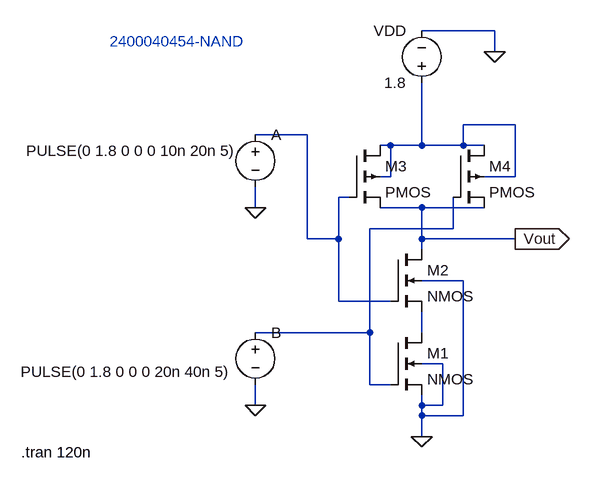
[diagram p0: schematic Nand Schematic Design.asc]
Nand Schematic Design.asc, the LTspice schematic file:
Version 4.1
SHEET 1 880 680
WIRE 368 -256 256 -256
WIRE 368 -224 368 -256
WIRE 400 -112 320 -112
WIRE 80 -96 0 -96
WIRE 208 -80 192 -80
WIRE 256 -80 256 -176
WIRE 256 -80 208 -80
WIRE 320 -80 320 -112
WIRE 320 -80 256 -80
WIRE 352 -80 320 -80
WIRE 208 -32 208 -80
WIRE 208 -32 192 -32
WIRE 400 -32 400 -112
WIRE 400 -32 352 -32
WIRE 144 0 128 0
WIRE 0 16 0 -16
WIRE 256 16 192 16
WIRE 352 16 256 16
WIRE 304 48 304 0
WIRE 304 48 176 48
WIRE 80 64 80 -96
WIRE 128 64 128 0
WIRE 128 64 80 64
WIRE 256 64 256 16
WIRE 400 64 256 64
WIRE 256 80 256 64
WIRE 320 128 256 128
WIRE 128 160 128 64
WIRE 208 160 128 160
WIRE 176 208 176 48
WIRE 176 208 0 208
WIRE 256 208 256 176
WIRE 288 256 256 256
WIRE 176 288 176 208
WIRE 208 288 176 288
WIRE 0 320 0 288
WIRE 256 320 256 304
WIRE 288 320 288 256
WIRE 288 320 256 320
WIRE 256 336 256 320
WIRE 320 336 320 128
WIRE 320 336 256 336
WIRE 256 368 256 336
FLAG 256 368 0
FLAG 400 64 Vout
IOPIN 400 64 Out
FLAG 0 16 0
FLAG 0 320 0
FLAG 368 -224 0
SYMBOL nmos4 208 208 R0
SYMATTR InstName M1
SYMBOL nmos4 208 80 R0
SYMATTR InstName M2
SYMBOL pmos4 144 -80 R0
SYMATTR InstName M3
SYMBOL pmos4 304 -80 R0
SYMATTR InstName M4
SYMBOL voltage 0 -112 R0
WINDOW 3 -353 40 Left 2
WINDOW 123 0 0 Left 0
WINDOW 39 0 0 Left 0
SYMATTR Value PULSE(0 1.8 0 0 0 10n 20n 5)
SYMATTR InstName A
SYMBOL voltage 0 192 R0
WINDOW 3 -361 76 Left 2
WINDOW 123 0 0 Left 0
WINDOW 39 0 0 Left 0
SYMATTR Value PULSE(0 1.8 0 0 0 20n 40n 5)
SYMATTR InstName B
SYMBOL voltage 256 -160 R180
WINDOW 0 24 96 Left 2
WINDOW 3 24 16 Left 2
SYMATTR InstName VDD
SYMATTR Value 1.8
TEXT -360 392 Left 2 !.tran 120n
TEXT -224 -240 Left 2 ;2400040454-NAND

The netlist it stands for:
* Nand Schematic Design.asc
M1 N004 N003 0 0 NMOS
M2 Vout N002 N004 0 NMOS
M3 N001 N002 Vout N001 PMOS
M4 N001 N003 Vout N001 PMOS
V§A N002 0 PULSE(0 1.8 0 0 0 10n 20n 5)
V§B N003 0 PULSE(0 1.8 0 0 0 20n 40n 5)
VDD N001 0 1.8
.model NMOS NMOS
.model PMOS PMOS
.lib standard.mos
.tran 120n
* 2400040454-NAND
.backanno
.end